# Altium project mag_pos.PrjPcb
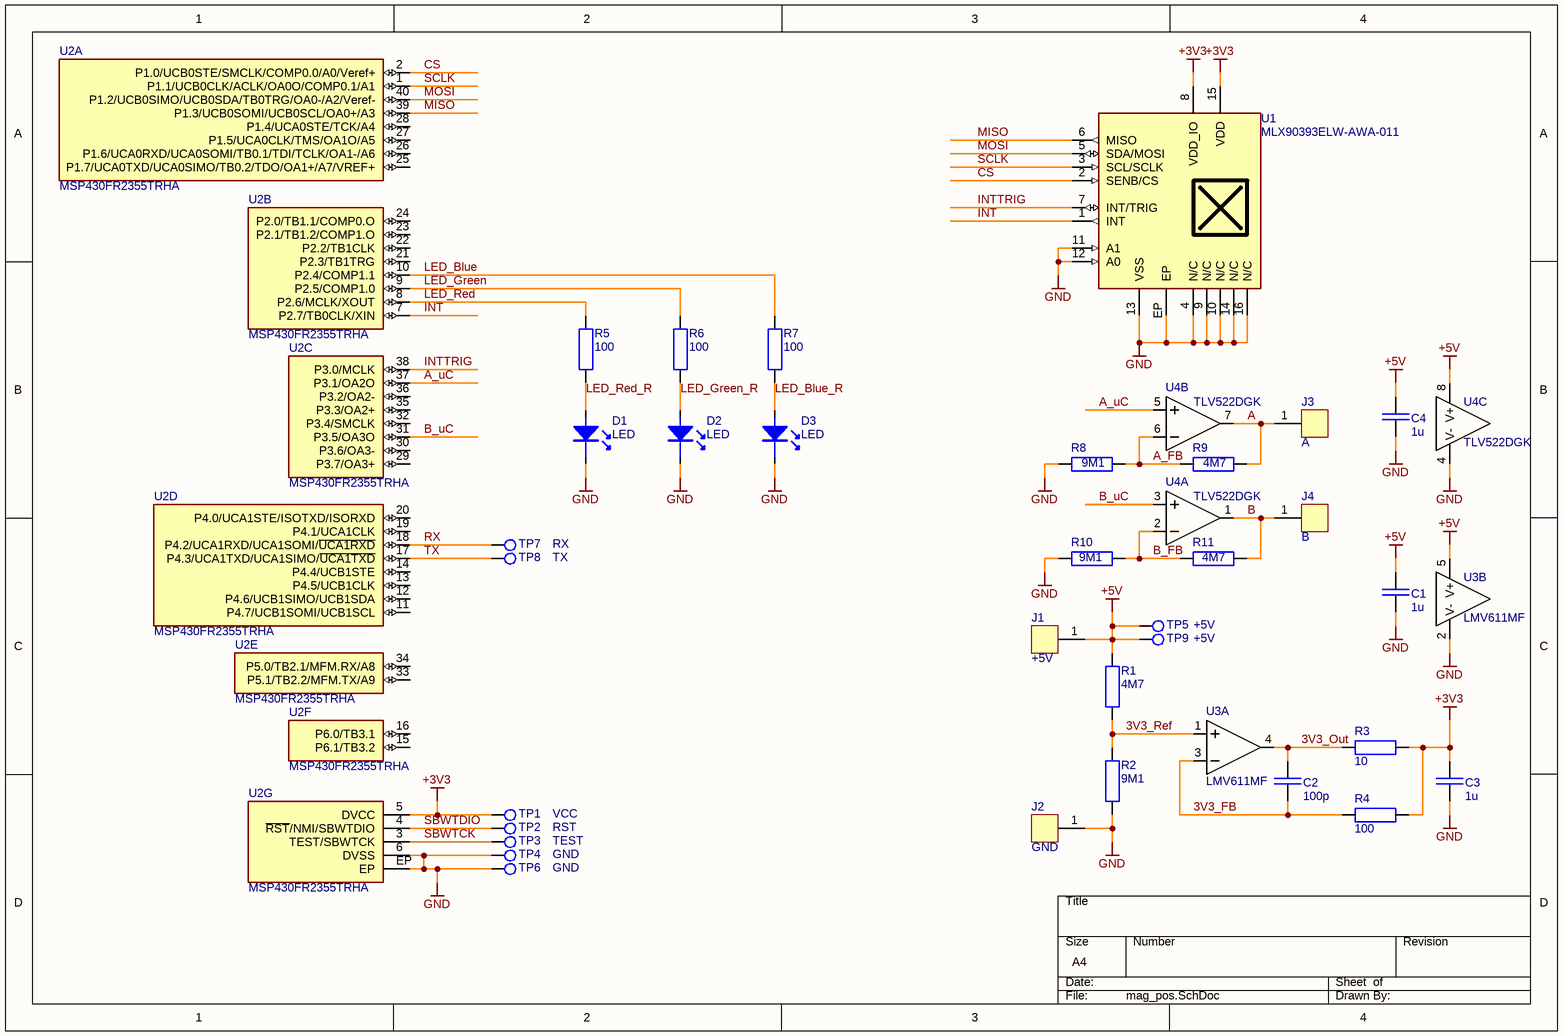
[diagram p0: mag_pos.SchDoc]
1 sheet, 35 parts. Net scope: global (net labels, ports and power ports of the same name join across sheets).
Board files: mag_pos.PcbDoc, mag_pos_nutz.PcbDoc, mag_pos_breakout.PcbDoc

## Sheet mag_pos.SchDoc
size A4

### Parts
C1  1u  [C_0603_S]
C2  100p  [C_0603_S]
C3  1u  [C_0603_S]
C4  1u  [C_0603_S]
D1  LED  [LED_0603_S_RED]
D2  LED  [LED_0603_S_GREEN]
D3  LED  [LED_0603_S_BLUE]
J1  +5V  [WIRE_1MM_1.5MM_THT]
J2  GND  [WIRE_1MM_1.5MM_THT]
J3  A  [WIRE_1MM_1.5MM_THT]
J4  B  [WIRE_1MM_1.5MM_THT]
R1  4M7  [R_0603_S]
R2  9M1  [R_0603_S]
R3  10  [R_0603_S]
R4  100  [R_0603_S]
R5  100  [R_0603_S]
R6  100  [R_0603_S]
R7  100  [R_0603_S]
R8  9M1  [R_0603_S]
R9  4M7  [R_0603_S]
R10  9M1  [R_0603_S]
R11  4M7  [R_0603_S]
TP1  VCC  [TP_SMD_1MM]
TP2  RST  [TP_SMD_1MM]
TP3  TEST  [TP_SMD_1MM]
TP4  GND  [TP_SMD_1MM]
TP5  +5V  [TP_SMD_1MM]
TP6  GND  [TP_SMD_1MM]
TP7  RX  [TP_SMD_1MM]
TP8  TX  [TP_SMD_1MM]
TP9  +5V  [TP_SMD_1MM]
U1  MLX90393ELW-AWA-011  [QFN50P300X300X100-16]
U2  MSP430FR2355TRHA  [QFN50P600X600X100-40]  (parts A,B,C,D,E,F,G of 7)
U3  LMV611MF  [SOT23-5_1.45]  (parts A,B of 2)
U4  TLV522DGK  [SOP65P500X300X110-8]  (parts A,B,C of 3)

### Nets
+3V3: C3.1 R3.2 R4.2 TP1.1 U1.8(VDD_IO) U1.15(VDD) U2.5(DVCC)
+5V: C1.1 C4.1 J1.1 R1.1 TP5.1 TP9.1 U3.5(V+) U4.8(V+)
GND: C1.2 C3.2 C4.2 D1.K D2.K D3.K J2.1 R2.2 R8.2 R10.2 TP4.1 TP6.1 U1.4(N/C) U1.9(N/C) U1.10(N/C) U1.11(A1) U1.12(A0) U1.13(VSS) U1.14(N/C) U1.16(N/C) U1.EP U2.6(DVSS) U2.EP U3.2(V-) U4.4(V-)
3V3_FB: C2.2 R4.1 U3.3(-IN)
3V3_Out: C2.1 R3.1 U3.4
3V3_Ref: R1.2 R2.1 U3.1(+IN)
A: J3.1 R9.1 U4.7(Out)
A_FB: R8.1 R9.2 U4.6(-IN)
A_uC: U2.37(P3.1/OA2O) U4.5(+IN)
B: J4.1 R11.1 U4.1(Out)
B_FB: R10.1 R11.2 U4.2(-IN)
B_uC: U2.31(P3.5/OA3O) U4.3(+IN)
CS: U1.2(SENB/CS) U2.2(P1.0/UCB0STE/SMCLK/COMP0.0/A0/Veref+)
INT: U1.1(INT) U2.7(P2.7/TB0CLK/XIN)
INTTRIG: U1.7(INT/TRIG) U2.38(P3.0/MCLK)
LED_Blue: R7.2 U2.10(P2.4/COMP1.1)
LED_Blue_R: D3.A R7.1
LED_Green: R6.2 U2.9(P2.5/COMP1.0)
LED_Green_R: D2.A R6.1
LED_Red: R5.2 U2.8(P2.6/MCLK/XOUT)
LED_Red_R: D1.A R5.1
MISO: U1.6(MISO) U2.39(P1.3/UCB0SOMI/UCB0SCL/OA0+/A3)
MOSI: U1.5(SDA/MOSI) U2.40(P1.2/UCB0SIMO/UCB0SDA/TB0TRG/OA0-/A2/Veref-)
RX: TP7.1 U2.18(P4.2/UCA1RXD/UCA1SOMI/~{UCA1RXD})
SBWTCK: TP3.1 U2.3(TEST/SBWTCK)
SBWTDIO: TP2.1 U2.4(~{RST}/NMI/SBWTDIO)
SCLK: U1.3(SCL/SCLK) U2.1(P1.1/UCB0CLK/ACLK/OA0O/COMP0.1/A1)
TX: TP8.1 U2.17(P4.3/UCA1TXD/UCA1SIMO/~{UCA1TXD})

Not connected (* = marked no-connect by the designer): U2 11(P4.7/UCB1SOMI/UCB1SCL) 12(P4.6/UCB1SIMO/UCB1SDA) 13(P4.5/UCB1CLK) 14(P4.4/UCB1STE) 15(P6.1/TB3.2) 16(P6.0/TB3.1) 19(P4.1/UCA1CLK) 20(P4.0/UCA1STE/ISOTXD/ISORXD) 21(P2.3/TB1TRG) 22(P2.2/TB1CLK) 23(P2.1/TB1.2/COMP1.O) 24(P2.0/TB1.1/COMP0.O) 25(P1.7/UCA0TXD/UCA0SIMO/TB0.2/TDO/OA1+/A7/VREF+) 26(P1.6/UCA0RXD/UCA0SOMI/TB0.1/TDI/TCLK/OA1-/A6) 27(P1.5/UCA0CLK/TMS/OA1O/A5) 28(P1.4/UCA0STE/TCK/A4) 29(P3.7/OA3+) 30(P3.6/OA3-) 32(P3.4/SMCLK) 33(P5.1/TB2.2/MFM.TX/A9) 34(P5.0/TB2.1/MFM.RX/A8) 35(P3.3/OA2+) 36(P3.2/OA2-)

### Library data of the parts
C1-C4 = C
J1-J4 = Wire_1MM: 1mm Wire; System: Connector
R1-R11 = R: Normaler Widerstand
TP1-TP9 = TP_SMD_1mm: Testpoint SMD 1mm
U1 = MLX90393ELW-AWA-011: Triaxis Magnetic Node, QFN16
U2 = MSP430FR2355TRHA: Mixed-Signal Microcontroller, 16Bit, 32kB FRAM, 4kB SRAM, QFN40
U3 = LMV611MF: LMV611 SOT-23-5 Single, 1.4-MHz, Low-Power, General-Purpose 1.8-V Operational Amplifier; Manufacturer: TI; Footprint: SOT23-5 (TI DBV); HelpURL: https://www.ti.com/lit/ds/symlink/lmv611.pdf
U4 = TLV522DGK: TLV522 VSSOP-8 Dual Nanopower, 500nA, RRIO CMOS Operational Amplifier; Manufacturer: TI; Footprint: VSSOP-8 (TI DGK); HelpURL: https://www.ti.com/lit/ds/symlink/tlv522.pdf